# EAGLE design AGC_INDIC (EAGLE 7.4.0)
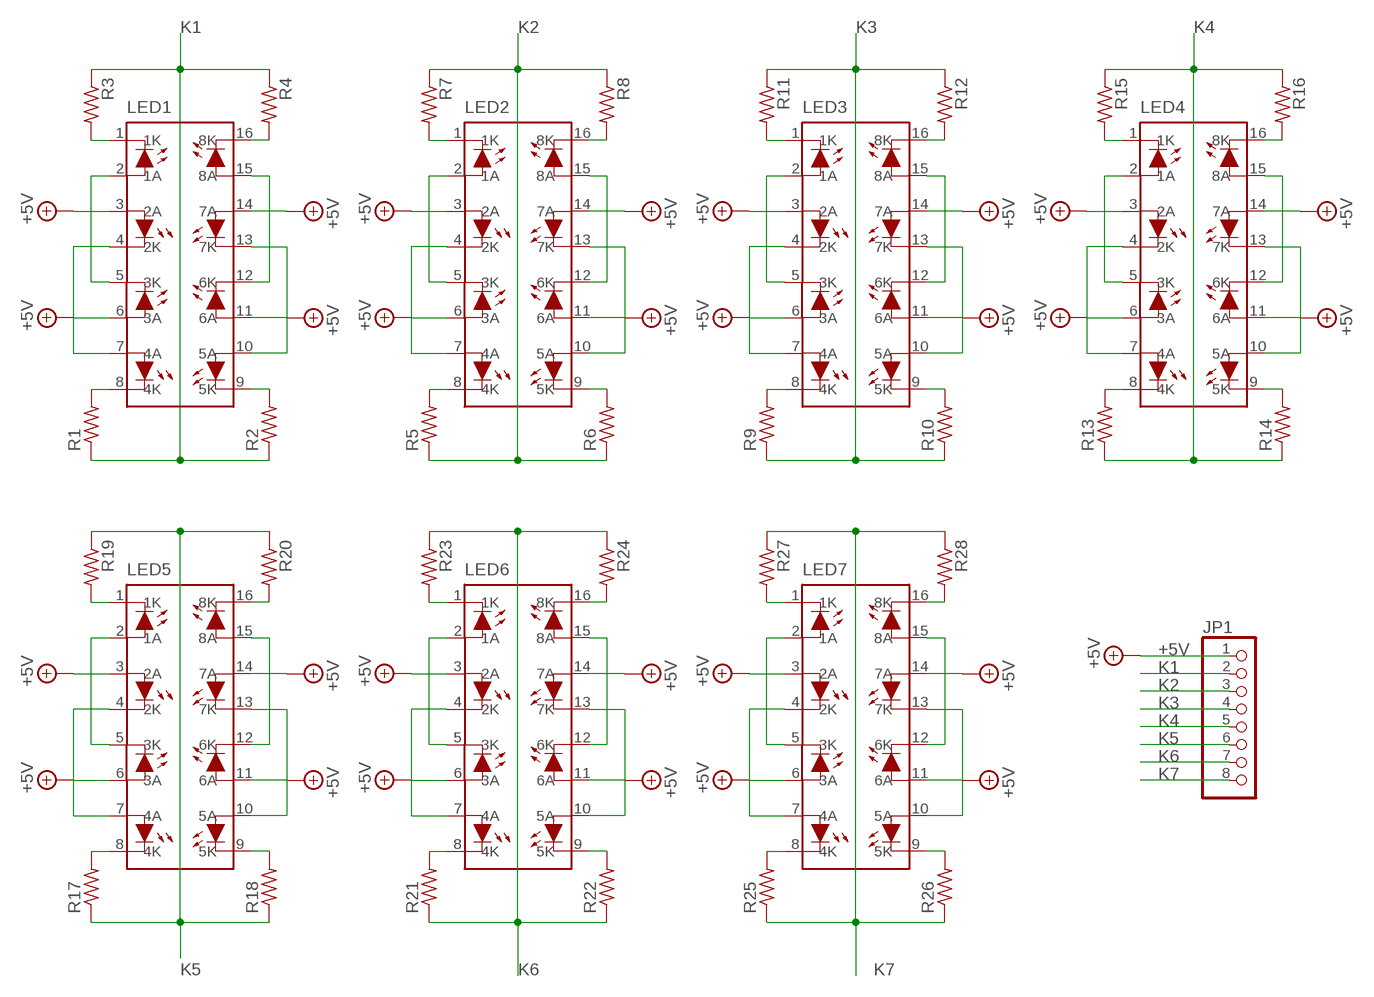
[diagram p0: schematic, sheet 1]

## Parts
JP1  PINHD-1X8  [1X08]
LED1  HCLP-E  [E100-16]
LED2  HCLP-E  [E100-16]
LED3  HCLP-E  [E100-16]
LED4  HCLP-E  [E100-16]
LED5  HCLP-E  [E100-16]
LED6  HCLP-E  [E100-16]
LED7  HCLP-E  [E100-16]
R1  R-US_0204/5  [0204/5]
R2  R-US_0204/5  [0204/5]
R3  R-US_0204/5  [0204/5]
R4  R-US_0204/5  [0204/5]
R5  R-US_0204/5  [0204/5]
R6  R-US_0204/5  [0204/5]
R7  R-US_0204/5  [0204/5]
R8  R-US_0204/5  [0204/5]
R9  R-US_0204/5  [0204/5]
R10  R-US_0204/5  [0204/5]
R11  R-US_0204/5  [0204/5]
R12  R-US_0204/5  [0204/5]
R13  R-US_0204/5  [0204/5]
R14  R-US_0204/5  [0204/5]
R15  R-US_0204/5  [0204/5]
R16  R-US_0204/5  [0204/5]
R17  R-US_0204/5  [0204/5]
R18  R-US_0204/5  [0204/5]
R19  R-US_0204/5  [0204/5]
R20  R-US_0204/5  [0204/5]
R21  R-US_0204/5  [0204/5]
R22  R-US_0204/5  [0204/5]
R23  R-US_0204/5  [0204/5]
R24  R-US_0204/5  [0204/5]
R25  R-US_0204/5  [0204/5]
R26  R-US_0204/5  [0204/5]
R27  R-US_0204/5  [0204/5]
R28  R-US_0204/5  [0204/5]

## Nets
+5V: JP1.1 LED1.3(2A) LED1.6(3A) LED1.11(6A) LED1.14(7A) LED2.3(2A) LED2.6(3A) LED2.11(6A) LED2.14(7A) LED3.3(2A) LED3.6(3A) LED3.11(6A) LED3.14(7A) LED4.3(2A) LED4.6(3A) LED4.11(6A) LED4.14(7A) LED5.3(2A) LED5.6(3A) LED5.11(6A) LED5.14(7A) LED6.3(2A) LED6.6(3A) LED6.11(6A) LED6.14(7A) LED7.3(2A) LED7.6(3A) LED7.11(6A) LED7.14(7A)
K1: JP1.2 R1.1 R2.1 R3.1 R4.1
K2: JP1.3 R5.1 R6.1 R7.1 R8.1
K3: JP1.4 R9.1 R10.1 R11.1 R12.1
K4: JP1.5 R13.1 R14.1 R15.1 R16.1
K5: JP1.6 R17.1 R18.1 R19.1 R20.1
K6: JP1.7 R21.1 R22.1 R23.1 R24.1
K7: JP1.8 R25.1 R26.1 R27.1 R28.1
N$1: LED1.2(1A) LED1.5(3K)
N$2: LED1.4(2K) LED1.7(4A)
N$3: LED1.12(6K) LED1.15(8A)
N$4: LED1.10(5A) LED1.13(7K)
N$5: LED1.8(4K) R1.2
N$6: LED1.9(5K) R2.2
N$7: LED1.1(1K) R3.2
N$8: LED1.16(8K) R4.2
N$10: LED2.2(1A) LED2.5(3K)
N$11: LED2.4(2K) LED2.7(4A)
N$12: LED2.12(6K) LED2.15(8A)
N$13: LED2.10(5A) LED2.13(7K)
N$14: LED2.8(4K) R5.2
N$15: LED2.9(5K) R6.2
N$16: LED2.1(1K) R7.2
N$17: LED2.16(8K) R8.2
N$19: LED3.2(1A) LED3.5(3K)
N$20: LED3.4(2K) LED3.7(4A)
N$21: LED3.12(6K) LED3.15(8A)
N$22: LED3.10(5A) LED3.13(7K)
N$23: LED3.8(4K) R9.2
N$24: LED3.9(5K) R10.2
N$25: LED3.1(1K) R11.2
N$26: LED3.16(8K) R12.2
N$28: LED4.2(1A) LED4.5(3K)
N$29: LED4.4(2K) LED4.7(4A)
N$30: LED4.12(6K) LED4.15(8A)
N$31: LED4.10(5A) LED4.13(7K)
N$32: LED4.8(4K) R13.2
N$33: LED4.9(5K) R14.2
N$34: LED4.1(1K) R15.2
N$35: LED4.16(8K) R16.2
N$37: LED5.2(1A) LED5.5(3K)
N$38: LED5.4(2K) LED5.7(4A)
N$39: LED5.12(6K) LED5.15(8A)
N$40: LED5.10(5A) LED5.13(7K)
N$41: LED5.8(4K) R17.2
N$42: LED5.9(5K) R18.2
N$43: LED5.1(1K) R19.2
N$44: LED5.16(8K) R20.2
N$46: LED6.2(1A) LED6.5(3K)
N$47: LED6.4(2K) LED6.7(4A)
N$48: LED6.12(6K) LED6.15(8A)
N$49: LED6.10(5A) LED6.13(7K)
N$50: LED6.8(4K) R21.2
N$51: LED6.9(5K) R22.2
N$52: LED6.1(1K) R23.2
N$53: LED6.16(8K) R24.2
N$55: LED7.2(1A) LED7.5(3K)
N$56: LED7.4(2K) LED7.7(4A)
N$57: LED7.12(6K) LED7.15(8A)
N$58: LED7.10(5A) LED7.13(7K)
N$59: LED7.8(4K) R25.2
N$60: LED7.9(5K) R26.2
N$61: LED7.1(1K) R27.2
N$62: LED7.16(8K) R28.2

## Library data of the parts
JP1 = pinhead:PINHD-1X8: PIN HEADER
LED1-LED7 = HLCP-H100:HCLP-: HLCP-X100 and HLMP-2XXX series LED Light Bars Description The HLCP-X100 and HLMP-2XXX series light bars are rectangular light sources designed for a variety of applications where a large bright source of light is required. These light bars are configured in singlein- line and dual-in-line packages that contain either single or segmented light emitting areas. The AlGaAs Red HLCP-X100 series LEDs use double heterojunction AlGaAs on a GaAs substrate. The HER HLMP-2300/2600 and Yellow HLMP-2400/2700 series LEDs have their p-n junctions diffused into a GaAsP epitaxial layer on a GaP substrate. The Green HLMP- 2500/2800 series LEDs use a liquid phase GaP epitaxial layer on a GaP substrate. The bicolor HLMP- 2900 series use a combination of HER/Yellow or HER/ Green LEDs.
R1-R28 = rcl:R-US_: RESISTOR, American symbol

## Board
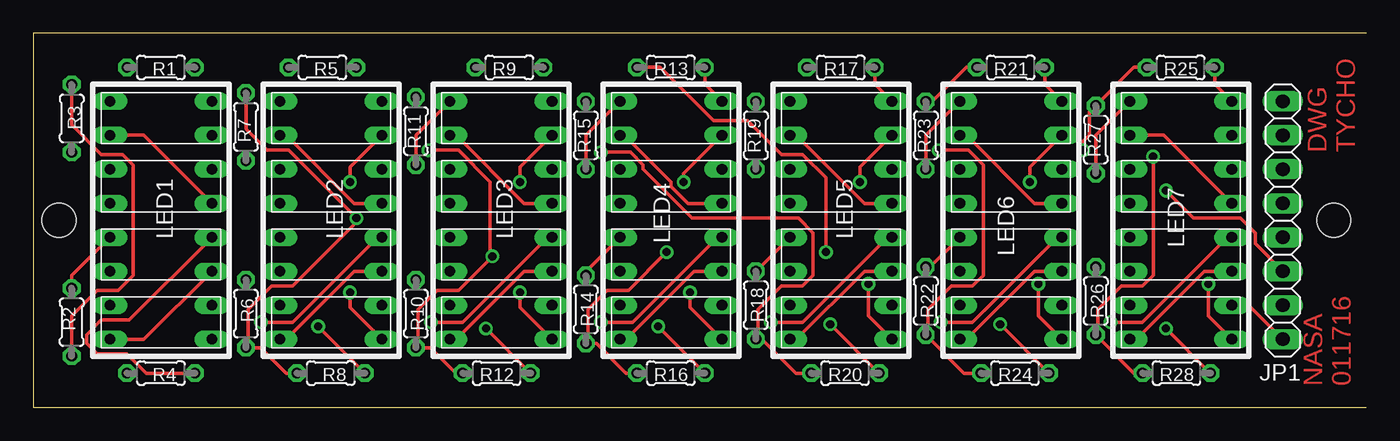
[diagram p1: board, top side]
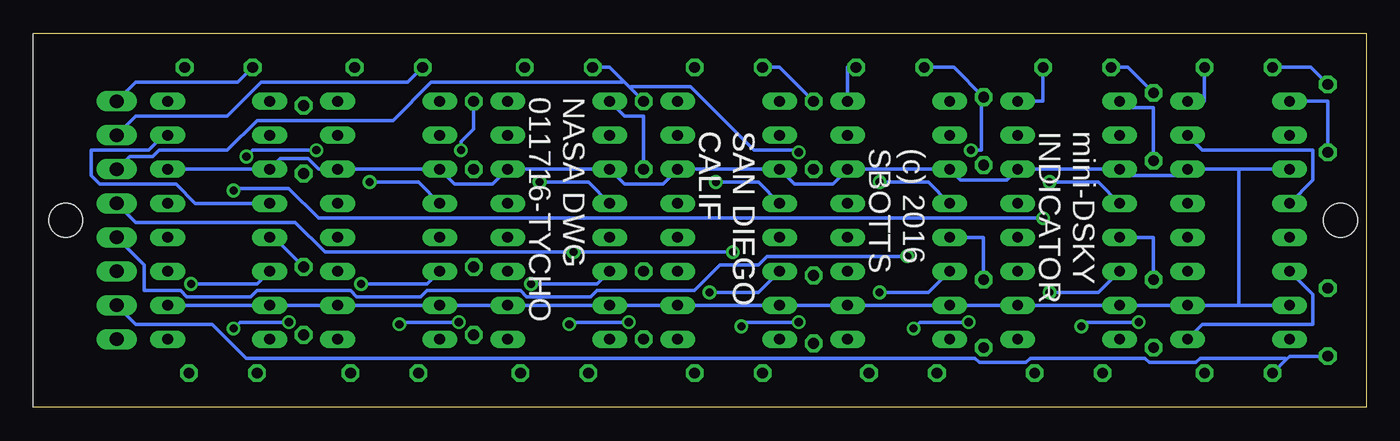
[diagram p2: board, bottom side, seen from below]

Size 99.57 x 27.94 mm. Coordinates in mm from the lower left corner, seen from the top.
Outline: 99.57,0 0,0 0,27.94 99.57,27.94
Copper layers (1*16): Top 0.035mm / dielectric 1.5mm / Bottom 0.035mm
Design rules "default": minimum track width 10mil, minimum drill 24mil, track to track 8mil, track to pad 8mil, pad to pad 8mil, via to via 8mil, smd to smd 8mil, copper to edge 40mil, drill to drill 8mil, minimum pad ring 10mil, minimum via ring 8mil, stop-mask expansion 4mil, vias tented up to drill 0mil, thermal gap 10mil
Holes 2.54 mm at 1.91,13.97 97.16,13.97

### Footprints (pad centres in the part's own frame; a part is rotated, then mirrored left to right if it is on the bottom)
1X08 = drill 1.016 long: 1 -8.89,0; 2 -6.35,0; 3 -3.81,0; 4 -1.27,0; 5 1.27,0; 6 3.81,0; 7 6.35,0; 8 8.89,0
E100-16 = drill 0.813 long: 1 -3.81,-3.81; 2 -1.27,-3.81; 3 1.27,-3.81; 4 3.81,-3.81; 5 3.81,3.81; 6 1.27,3.81; 7 -1.27,3.81; 8 -3.81,3.81; 9 6.35,-3.81; 10 8.89,-3.81; 11 11.43,-3.81; 12 13.97,-3.81; 13 13.97,3.81; 14 11.43,3.81; 15 8.89,3.81; 16 6.35,3.81
0204/5 = drill 0.813 octagon: 1 -2.54,0; 2 2.54,0

### Placement (x,y rotation side)
JP1  93.34,13.97 90 top
LED1  9.53,19.05 270 top
LED2  22.23,19.05 270 top
LED3  34.92,19.05 270 top
LED4  47.62,19.05 270 top
LED5  60.33,19.05 270 top
LED6  73.03,19.05 270 top
LED7  85.72,19.05 270 top
R1  9.53,25.4 0 top
R2  2.86,6.35 90 top
R3  2.86,21.59 270 top
R4  9.53,2.54 0 top
R5  21.59,25.4 0 top
R6  15.88,6.99 90 top
R7  15.88,20.95 270 top
R8  22.23,2.54 0 top
R9  35.56,25.4 0 top
R10  28.57,6.99 90 top
R11  28.57,20.64 270 top
R12  34.61,2.54 0 top
R13  47.62,25.4 0 top
R14  41.27,7.3 90 top
R15  41.27,20.32 270 top
R16  47.62,2.54 0 top
R17  60.33,25.4 0 top
R18  53.98,7.62 90 top
R19  53.98,20.32 270 top
R20  60.64,2.54 0 top
R21  73.03,25.4 0 top
R22  66.67,7.94 90 top
R23  66.67,20.32 270 top
R24  73.34,2.54 0 top
R25  85.72,25.4 0 top
R26  79.38,7.94 90 top
R27  79.38,20 270 top
R28  85.41,2.54 0 top

### Tracks (layer width: path | path; a pad name or v marks a point on that pad's centre or on a via)
+5V
  Top 0.254: LED7.14 90.81,7.62 JP1.1
  Bottom 0.254: LED7.6 LED7.3 81.12,18.57 79.06,18.57 78.26,17.78 LED6.6 LED6.3 68.1,16.67 65.25,16.67 LED5.6 LED5.3 55.4,16.67 52.55,16.67 LED4.6 LED4.3 42.7,16.67 39.85,16.67 LED3.6 LED3.3 30.32,16.99 26.83,16.99 LED2.6 LED2.3 17.94,17.3 13.81,17.3 LED1.6 9.53,17.78 | 9.53,17.78 LED1.3 | 9.53,7.62 LED1.14 LED2.11 LED2.14 LED3.11 LED3.14 LED4.11 LED4.14 LED5.11 LED5.14 LED6.11 LED6.14 LED7.11 LED7.14 | 9.53,7.62 LED1.11 | 9.53,7.62 9.53,17.78
K1
  Top 0.254: R3.1 2.86,21.11 5.08,18.89 6.67,18.89 7.46,18.1 7.46,9.84 6.35,8.73 4.76,8.73 2.86,6.83 R2.1
  Bottom 0.254: R3.1 4.13,25.4 R1.1 | 5.95,3.57 5.71,3.81 R2.1 | 5.95,3.57 R4.1 | JP1.2 91.92,6.19 86.2,6.19 83.66,3.65 29.21,3.65 28.89,3.33 25.4,3.33 25.08,3.65 16.51,3.65 16.19,3.33 12.7,3.33 12.38,3.65 6.03,3.65 5.95,3.57
K2  (via drill 0.61)
  Top 0.254: 16.03,4.45 16.99,4.45 18.89,2.54 R8.1 | JP1.3 91.28,12.22 91.28,13.02 90.17,14.13 86.68,14.13 v84.61,16.19 | R7.1 15.88,20.8 17.46,19.21 19.05,19.21 v24.13,14.13 23.97,14.13 23.97,13.65 19.37,9.05 17.78,9.05 16.03,7.3 16.03,4.45 | 16.03,4.45 R6.1
  Bottom 0.254: R7.1 17.78,25.4 R5.1 | v84.61,16.19 84.45,16.35 80.49,16.35 78.26,14.13 v24.13,14.13
K3  (via drill 0.61)
  Top 0.254: 28.73,4.45 29.69,4.45 31.59,2.54 R12.1 | 28.73,4.45 28.73,7.3 30.16,8.73 31.75,8.73 v34.29,11.27 34.13,11.27 34.13,16.83 31.75,19.21 v29.53,19.21 | 28.73,4.45 R10.1
  Bottom 0.254: R9.1 30.8,25.4 R11.1 28.73,23.18 28.73,19.21 v29.53,19.21 | JP1.4 91.28,10.64 91.28,8.73 88.58,8.73 88.11,8.26 83.34,8.26 82.87,8.73 75.88,8.73 75.41,8.26 70.64,8.26 70.17,8.73 63.18,8.73 62.71,8.26 57.94,8.26 57.47,8.73 50.16,8.73 48.26,10.64 45.4,10.64 44.77,11.27 v34.29,11.27
K4  (via drill 0.61)
  Top 0.254: 41.43,4.76 42.07,4.76 44.29,2.54 R16.1 | v47.31,11.59 44.45,8.73 42.86,8.73 41.43,7.3 41.43,4.76 | 41.43,4.76 R14.1 | R13.1 46.83,25.4 50.8,21.43 53.34,21.43 55.88,18.89 57.47,18.89 59.21,17.14 v59.21,11.59
  Bottom 0.254: R15.1 43.81,25.4 R13.1 | JP1.5 91.92,13.81 80.01,13.81 77.79,11.59 v59.21,11.59 v47.31,11.59
K5  (via drill 0.61)
  Top 0.254: 54.13,5.08 54.45,5.08 56.99,2.54 R20.1 | 54.13,5.08 54.13,7.3 55.88,9.05 57.47,9.05 58.26,9.84 58.26,13.02 57.15,14.13 49.21,14.13 45.56,17.78 45.56,18.1 44.61,19.05 v42.39,19.05 | 54.13,5.08 R18.1
  Bottom 0.254: 55.48,24.37 56.52,25.4 R17.1 | 55.48,24.37 55.01,23.89 | 55.01,23.89 R19.1 | JP1.6 92.39,18.73 90.65,18.73 90.17,19.21 85.09,19.21 82.87,21.43 72.71,21.43 69.85,24.29 55.56,24.29 55.48,24.37 | v42.39,19.05 42.55,19.21 45.72,19.21 50.48,23.97 54.93,23.97 55.01,23.89
K6  (via drill 0.61)
  Top 0.254: R24.1 69.53,2.54 R22.1 66.83,5.4 66.83,7.3 68.58,9.05 70.17,9.05 70.96,9.84 70.96,18.1 69.85,19.21 v67.63,19.21 | R23.1 67.15,22.86 69.69,25.4 R21.1
  Bottom 0.254: JP1.7 91.92,21.75 85.09,21.75 82.55,24.29 71.6,24.29 R21.1 | v67.63,19.21 67.63,19.84 66.67,20.8 R23.1
K7  (via drill 0.61)
  Top 0.254: R28.1 82.23,2.54 R26.1 79.53,5.4 79.53,7.3 81.28,9.05 82.87,9.05 83.66,9.84 v83.66,18.73 | R25.1 82.23,25.4 R27.1 78.9,22.07 78.9,20.32 78.42,19.84 v78.42,19.21
  Bottom 0.254: JP1.8 91.92,24.29 84.3,24.29 R25.1 | v83.66,18.73 83.19,19.21 v78.42,19.21
N$1
  Top 0.254: LED1.2 8.26,20.32 LED1.5
N$2
  Bottom 0.254: LED1.4 3.97,16.99 3.97,19.21 12.22,19.21 LED1.7
N$3
  Top 0.254: LED1.12 8.26,5.08 LED1.15
N$4
  Bottom 0.254: LED1.10 3.97,8.41 3.97,6.19 12.22,6.19 LED1.13
N$5
  Bottom 0.254: R1.2 12.06,22.86 LED1.8
N$6
  Top 0.254: R2.2 2.86,9.84 LED1.9
N$7
  Bottom 0.254: R3.2 2.86,22.86 LED1.1
N$8
  Top 0.254: R4.2 8.41,2.54 6.99,3.97 4.76,3.97 3.97,4.76 3.97,5.4 5.08,6.51 7.14,6.51 LED1.16
N$10
  Top 0.254: LED2.2 18.89,20.32 23.97,15.24 LED2.5
N$11  (via drill 0.61)
  Top 0.254: v23.65,16.83 23.65,17.94 LED2.7
  Bottom 0.254: LED2.4 20,16.83 v23.65,16.83
N$12
  Top 0.254: LED2.12 18.89,5.08 23.97,10.16 LED2.15
N$13  (via drill 0.61)
  Top 0.254: v23.65,8.57 23.65,7.46 LED2.13
  Bottom 0.254: LED2.10 20,8.57 v23.65,8.57
N$14
  Bottom 0.254: R5.2 24.13,22.86 LED2.8
N$15
  Bottom 0.254: R6.2 15.88,12.7 LED2.9
N$16
  Bottom 0.254: R7.2 15.88,22.38 17.94,22.38 LED2.1
N$17  (via drill 0.61)
  Top 0.254: v21.27,6.03 R8.2 | v16.99,6.35 19.37,6.35 25.72,12.7 LED2.16
  Bottom 0.254: v21.27,6.03 20.95,6.35 v16.99,6.35
N$19
  Top 0.254: LED3.2 31.59,20.32 36.67,15.24 LED3.5
N$20  (via drill 0.61)
  Top 0.254: v36.35,16.83 36.35,17.94 LED3.7
  Bottom 0.254: LED3.4 32.7,16.83 v36.35,16.83
N$21
  Top 0.254: LED3.12 31.59,5.08 36.67,10.16 LED3.15
N$22  (via drill 0.61)
  Top 0.254: v36.35,8.57 36.35,7.46 LED3.13
  Bottom 0.254: LED3.10 32.7,8.57 v36.35,8.57
N$23
  Bottom 0.254: LED3.8 38.73,25.4 R9.2
N$24
  Bottom 0.254: R10.2 28.57,12.7 LED3.9
N$25
  Top 0.254: R11.2 28.57,20.32 LED3.1
N$26  (via drill 0.61)
  Top 0.254: v33.81,5.87 R12.2 | v29.69,6.35 32.07,6.35 38.42,12.7 LED3.16
  Bottom 0.254: v33.81,5.87 33.34,6.35 v29.69,6.35
N$28
  Top 0.254: LED4.2 44.13,20.32 47.62,16.83 47.62,16.51 48.9,15.24 LED4.5
N$29  (via drill 0.61)
  Top 0.254: v48.58,16.83 48.58,17.46 LED4.7
  Bottom 0.254: LED4.4 45.4,16.83 v48.58,16.83
N$30
  Top 0.254: LED4.12 44.29,5.08 49.37,10.16 LED4.15
N$31  (via drill 0.61)
  Top 0.254: v49.05,8.57 49.05,7.46 LED4.13
  Bottom 0.254: LED4.10 45.4,8.57 v49.05,8.57
N$32
  Top 0.254: R13.2 50.16,24.13 LED4.8
N$33
  Top 0.254: R14.2 41.27,10.16 LED4.9
N$34
  Top 0.254: R15.2 41.27,20.32 LED4.1
N$35  (via drill 0.61)
  Top 0.254: v46.67,6.03 R16.2 | v42.39,6.35 44.77,6.35 51.12,12.7 LED4.16
  Bottom 0.254: v46.67,6.03 46.35,6.35 v42.39,6.35
N$37
  Top 0.254: LED5.2 56.99,20.32 62.07,15.24 LED5.5
N$38  (via drill 0.61)
  Top 0.254: v61.75,16.83 61.75,17.94 LED5.7
  Bottom 0.254: LED5.4 58.1,16.83 v61.75,16.83
N$39
  Top 0.254: LED5.12 56.99,5.08 62.07,10.16 LED5.15
N$40  (via drill 0.61)
  Top 0.254: v62.39,9.21 62.39,6.83 LED5.13
  Bottom 0.254: LED5.10 57.47,9.21 v62.39,9.21
N$41
  Top 0.254: R17.2 62.87,24.13 LED5.8
N$42
  Top 0.254: LED5.9 R18.2
N$43
  Bottom 0.254: R19.2 53.98,21.75 55.4,21.75 LED5.1
N$44  (via drill 0.61)
  Top 0.254: v59.53,6.19 R20.2 | v55.09,6.35 57.47,6.35 63.82,12.7 LED5.16
  Bottom 0.254: v59.53,6.19 59.37,6.35 v55.09,6.35
N$46
  Top 0.254: LED6.2 69.69,20.32 74.77,15.24 LED6.5
N$47  (via drill 0.61)
  Top 0.254: v74.45,16.83 74.45,17.94 LED6.7
  Bottom 0.254: LED6.4 70.8,16.83 v74.45,16.83
N$48
  Top 0.254: LED6.12 69.69,5.08 74.77,10.16 LED6.15
N$49  (via drill 0.61)
  Top 0.254: v75.09,9.21 75.09,6.83 LED6.13
  Bottom 0.254: LED6.10 70.17,9.21 v75.09,9.21
N$50
  Top 0.254: R21.2 75.56,24.13 LED6.8
N$51
  Top 0.254: R22.2 66.99,10.48 LED6.9
N$52
  Top 0.254: R23.2 66.67,20.32 LED6.1
N$53  (via drill 0.61)
  Top 0.254: v72.23,6.19 R24.2 | v67.79,6.35 70.17,6.35 76.52,12.7 LED6.16
  Bottom 0.254: v72.23,6.19 72.07,6.35 v67.79,6.35
N$55
  Top 0.254: LED7.2 84.45,20.32 LED7.5
N$56
  Bottom 0.254: LED7.4 87.47,15.24 88.9,16.67 94.61,16.67 95.25,17.3 95.25,19.21 90.96,19.21 89.85,20.32 LED7.7
N$57
  Top 0.254: LED7.12 82.39,5.08 87.47,10.16 LED7.15
N$58  (via drill 0.61)
  Top 0.254: v87.79,9.21 87.79,6.83 LED7.13
  Bottom 0.254: LED7.10 82.87,9.21 v87.79,9.21
N$59
  Top 0.254: R25.2 88.27,24.13 LED7.8
N$60
  Bottom 0.254: R26.2 81.6,12.7 LED7.9
N$61
  Top 0.254: R27.2 79.38,20.32 LED7.1
N$62  (via drill 0.61)
  Top 0.254: v84.61,5.87 R28.2 | v80.49,6.35 82.87,6.35 89.22,12.7 LED7.16
  Bottom 0.254: v84.61,5.87 84.14,6.35 v80.49,6.35

### Text on the board
Top: DWG / TYCHO | NASA / 011716
bPlace: NASA DWG / 011716-TYCHO | mini-DSKY / INDICATOR | SAN DIEGO / CALIF | SAN DIEGO / CALIF | (c) 2016 / SBOTTS
tStop: DWG / TYCHO | NASA / 011716